# EAGLE design music_box (EAGLE 9.6.2)
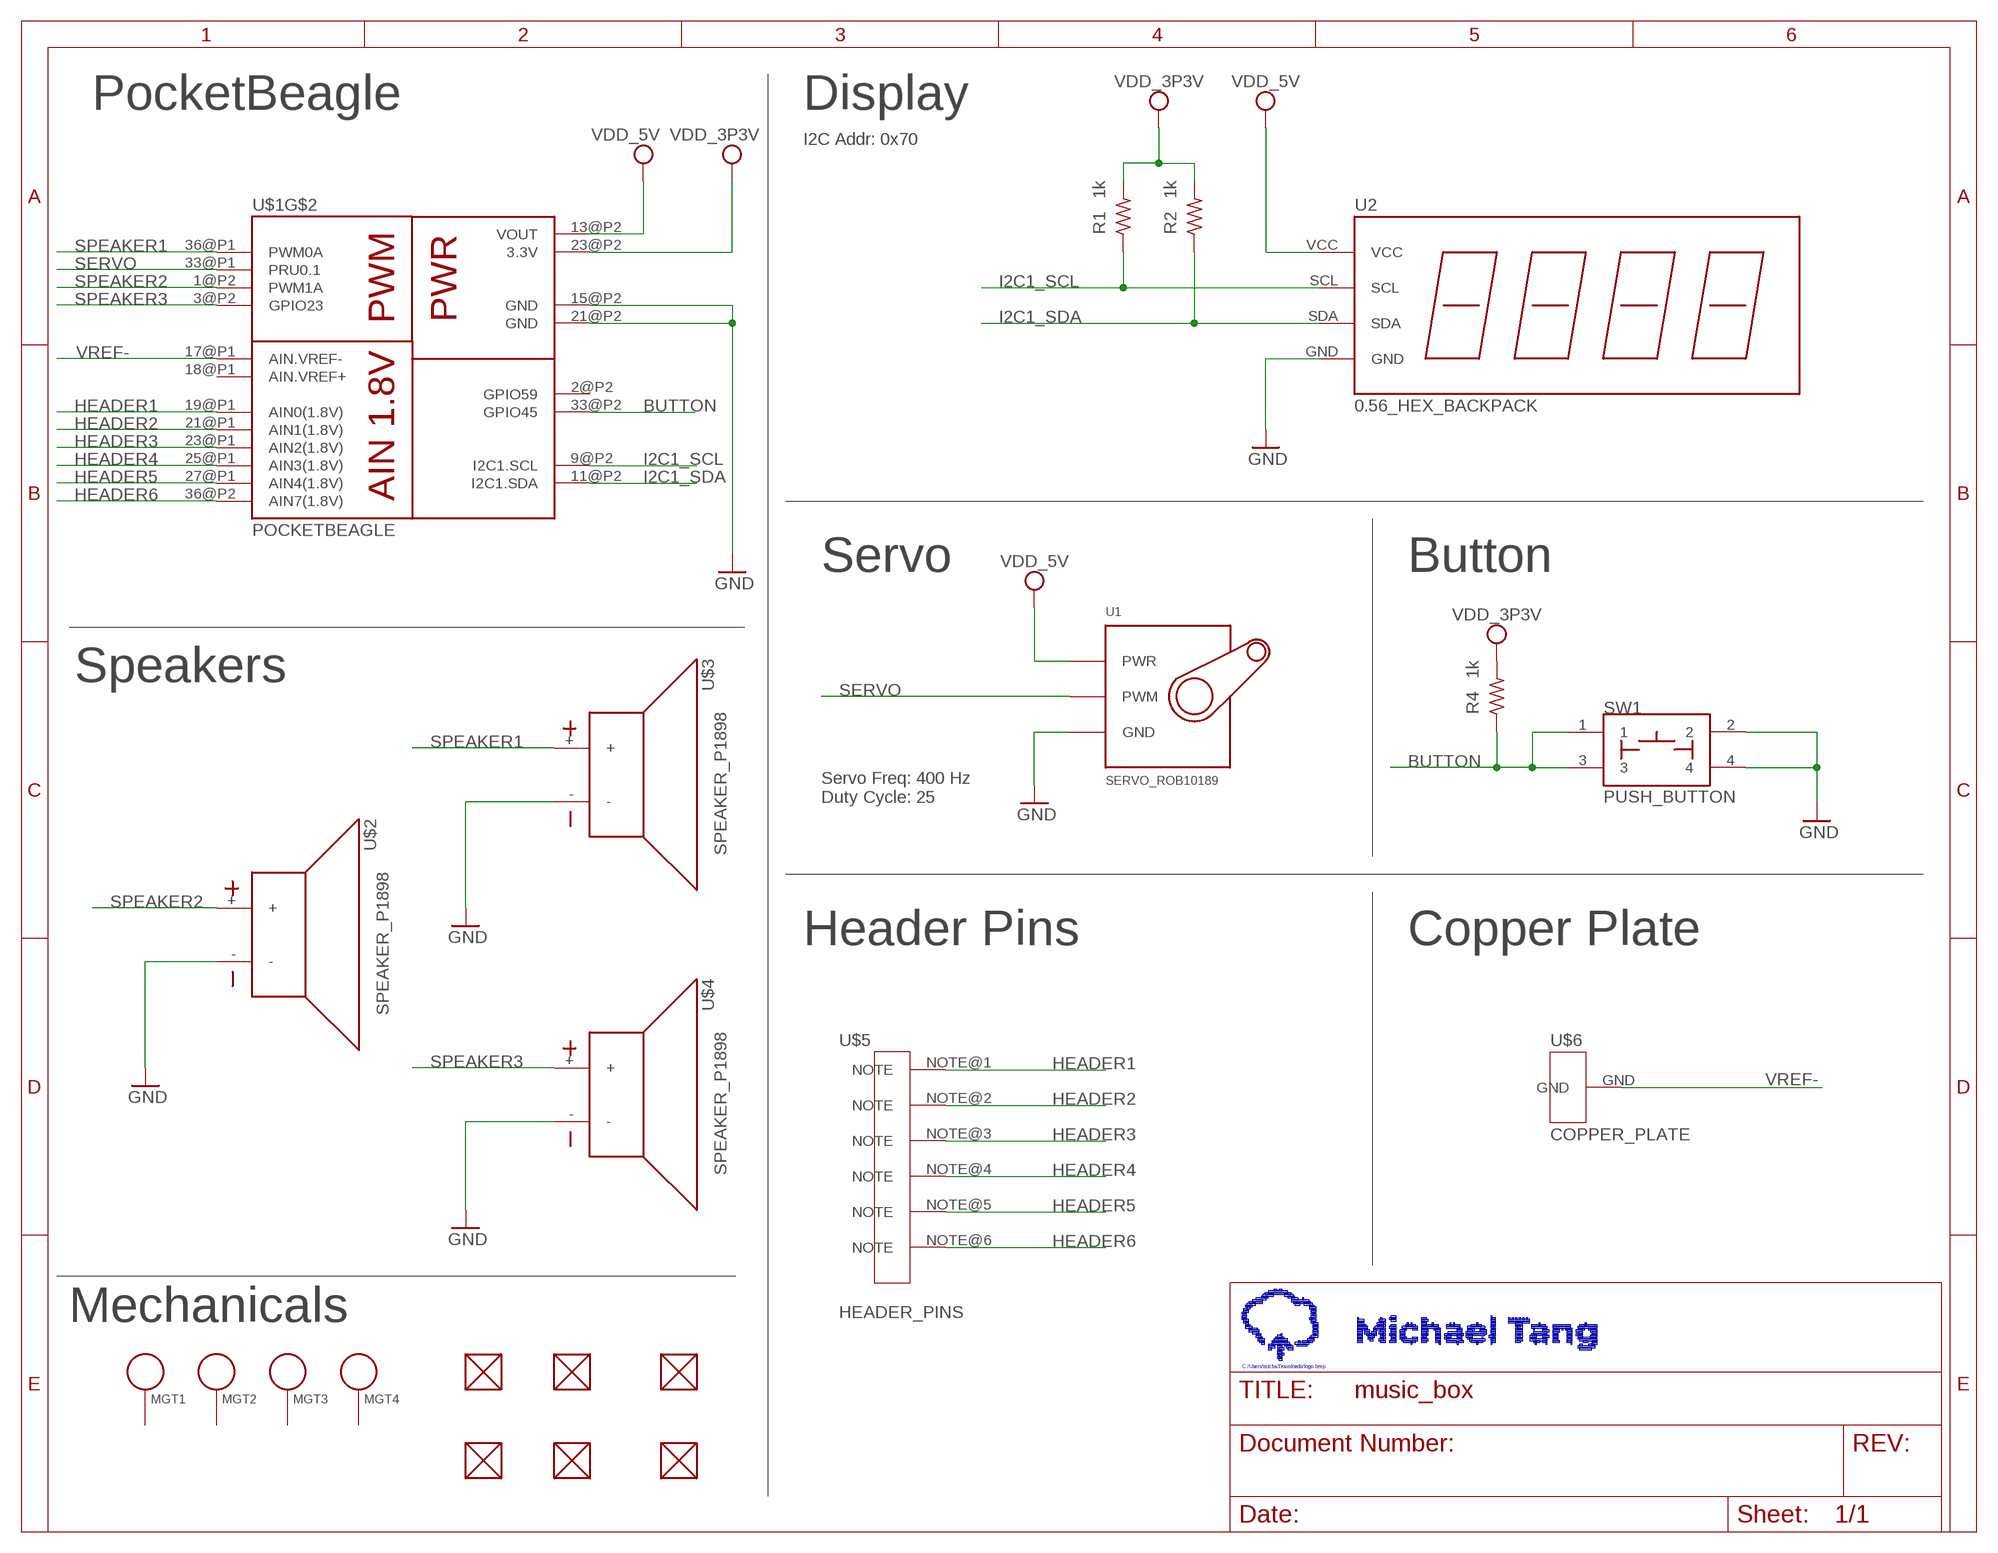
[diagram p0: schematic, sheet 1]

## Parts
FUD1  FIDUCIAL  [FIDUCIAL_40MIL]
FUD2  FIDUCIAL  [FIDUCIAL_40MIL]
FUD3  FIDUCIAL  [FIDUCIAL_40MIL]
FUD4  FIDUCIAL  [FIDUCIAL_40MIL]
FUD5  FIDUCIAL  [FIDUCIAL_40MIL]
FUD6  FIDUCIAL  [FIDUCIAL_40MIL]
MGT1  MOUNTING_HOLE  [MOUNTING_HOLE]
MGT2  MOUNTING_HOLE  [MOUNTING_HOLE]
MGT3  MOUNTING_HOLE  [MOUNTING_HOLE]
MGT4  MOUNTING_HOLE  [MOUNTING_HOLE]
R1  1k  R_R0603  [R0603]
R2  1k  R_R0603  [R0603]
R4  1k  R_R0603  [R0603]
SW1  PUSH_BUTTON  [BUTTON_12.5MM]
U1  SERVO_ROB10189  [SERVO-X1]
U2  0.56_HEX_BACKPACK  [0.56_HEX_BACKPACK]
U$1  POCKETBEAGLE  [POCKETBEAGLE]
U$2  SPEAKER_P1898  [SPEAKER]
U$3  SPEAKER_P1898  [SPEAKER]
U$4  SPEAKER_P1898  [SPEAKER]
U$5  HEADER_PINS  [HEADER_PINS]
U$6  COPPER_PLATE  [COPPER_PLATE]

## Nets
BUTTON: R4.1 SW1.1 SW1.3 U$1.33@P2(GPIO45)
GND: SW1.2 SW1.4 U1.GND U2.GND U$1.15@P2(GND) U$1.21@P2(GND) U$2.- U$3.- U$4.-
HEADER1: U$1.19@P1(AIN0(1.8V)) U$5.NOTE@1(NOTE)
HEADER2: U$1.21@P1(AIN1(1.8V)) U$5.NOTE@2(NOTE)
HEADER3: U$1.23@P1(AIN2(1.8V)) U$5.NOTE@3(NOTE)
HEADER4: U$1.25@P1(AIN3(1.8V)) U$5.NOTE@4(NOTE)
HEADER5: U$1.27@P1(AIN4(1.8V)) U$5.NOTE@5(NOTE)
HEADER6: U$1.36@P2(AIN7(1.8V)) U$5.NOTE@6(NOTE)
I2C1_SCL: R1.1 U2.SCL U$1.9@P2(I2C1.SCL)
I2C1_SDA: R2.1 U2.SDA U$1.11@P2(I2C1.SDA)
SERVO: U1.SIG(PWM) U$1.33@P1(PRU0.1)
SPEAKER1: U$1.36@P1(PWM0A) U$3.+
SPEAKER2: U$1.1@P2(PWM1A) U$2.+
SPEAKER3: U$1.3@P2(GPIO23) U$4.+
VDD_3P3V: R1.2 R2.2 R4.2 U$1.23@P2(3.3V)
VDD_5V: U1.PWR U2.VCC U$1.13@P2(VOUT)
VREF-: U$1.17@P1(AIN.VREF-) U$6.GND
Unconnected: FUD1.P$1 FUD2.P$1 FUD3.P$1 FUD4.P$1 FUD5.P$1 FUD6.P$1 MGT1.P$1 MGT2.P$1 MGT3.P$1 MGT4.P$1 U$1.1@P1(VIN) U$1.2@P1(AIN6/GPIO87) U$1.2@P2(GPIO59) U$1.3@P1(USB1.DRVVBUS) U$1.4@P1(GPIO89) U$1.4@P2(GPIO58) U$1.5@P1(USB1.VBUS) U$1.5@P2(UART4.RX) U$1.6@P1(SPI0.CS) U$1.6@P2(GPIO57) U$1.7@P1(USB1.VIN) U$1.7@P2(UART4.TX) U$1.8@P1(SPI0.CLK) U$1.8@P2(GPIO60) U$1.9@P1(USB1.D-) U$1.10@P1(SPI0.MISO) U$1.10@P2(GPIO52) U$1.11@P1(USB1.D+) U$1.12@P1(SPI0.MOSI) U$1.12@P2(PWR.BTN) U$1.13@P1(USB1.ID) U$1.14@P1(3.3V) U$1.14@P2(BAT.VIN) U$1.15@P1(GND) U$1.16@P1(GND) U$1.16@P2(BAT.TEMP) U$1.17@P2(GPIO65) U$1.18@P1(AIN.VREF+) U$1.18@P2(GPIO47) U$1.19@P2(GPIO27) U$1.20@P1(GPIO20) U$1.20@P2(GPIO64) U$1.22@P1(GND) U$1.22@P2(GPIO46) U$1.24@P1(VOUT) U$1.24@P2(GPIO44) U$1.25@P2(SPI1.MOSI) U$1.26@P1(I2C2.SDA) U$1.26@P2(RESET#) U$1.27@P2(SPI1.MISO) U$1.28@P1(I2C2.SCL) U$1.28@P2(PRU0.6) U$1.29@P1(PRU0.7) U$1.29@P2(SPI1.CLK) U$1.30@P1(UART0.TX) U$1.30@P2(PRU0.3) U$1.31@P1(PRU0.4) U$1.31@P2(SPI1.CS) U$1.32@P1(UART0.RX) U$1.32@P2(PRU0.2) U$1.34@P1(GPIO26) U$1.34@P2(PRU0.5) U$1.35@P1(PRU1.10) U$1.35@P2(AIN5(3.3V))

## Notes on the sheet
- PocketBeagle | Display
- I2C Addr: 0x70
- Servo | Button
- Speakers
- Servo Freq: 400 Hz
  Duty Cycle: 25
- Header Pins | Copper Plate
- Mechanicals
- C:/Users/micha/Downloads/logo.bmp

## Library data of the parts
FUD1-FUD6 = music_box:FIDUCIAL
MGT1-MGT4 = music_box:MOUNTING_HOLE: Chassis Mounting Hole w/GND connection ability
R1 R2 R4 = music_box:R_: RESISTOR, American symbol
SW1 = music_box:PUSH_BUTTON
U1 = music_box:SERVO_ROB10189
U2 = music_box:0.56_HEX_BACKPACK: 0.56" LED HEX Backback - Adafruit HT16K33 - https://www.adafruit.com/product/878 - https://www.adafruit.com/product/879 - https://www.adafruit.com/product/880 - https://www.adafruit.com/product/881 - https://www.adafruit.com/product/1002
U$1 = music_box:POCKETBEAGLE
U$2-U$4 = music_box:SPEAKER_P1898
U$5 = music_box:HEADER_PINS
U$6 = music_box:COPPER_PLATE

## Board
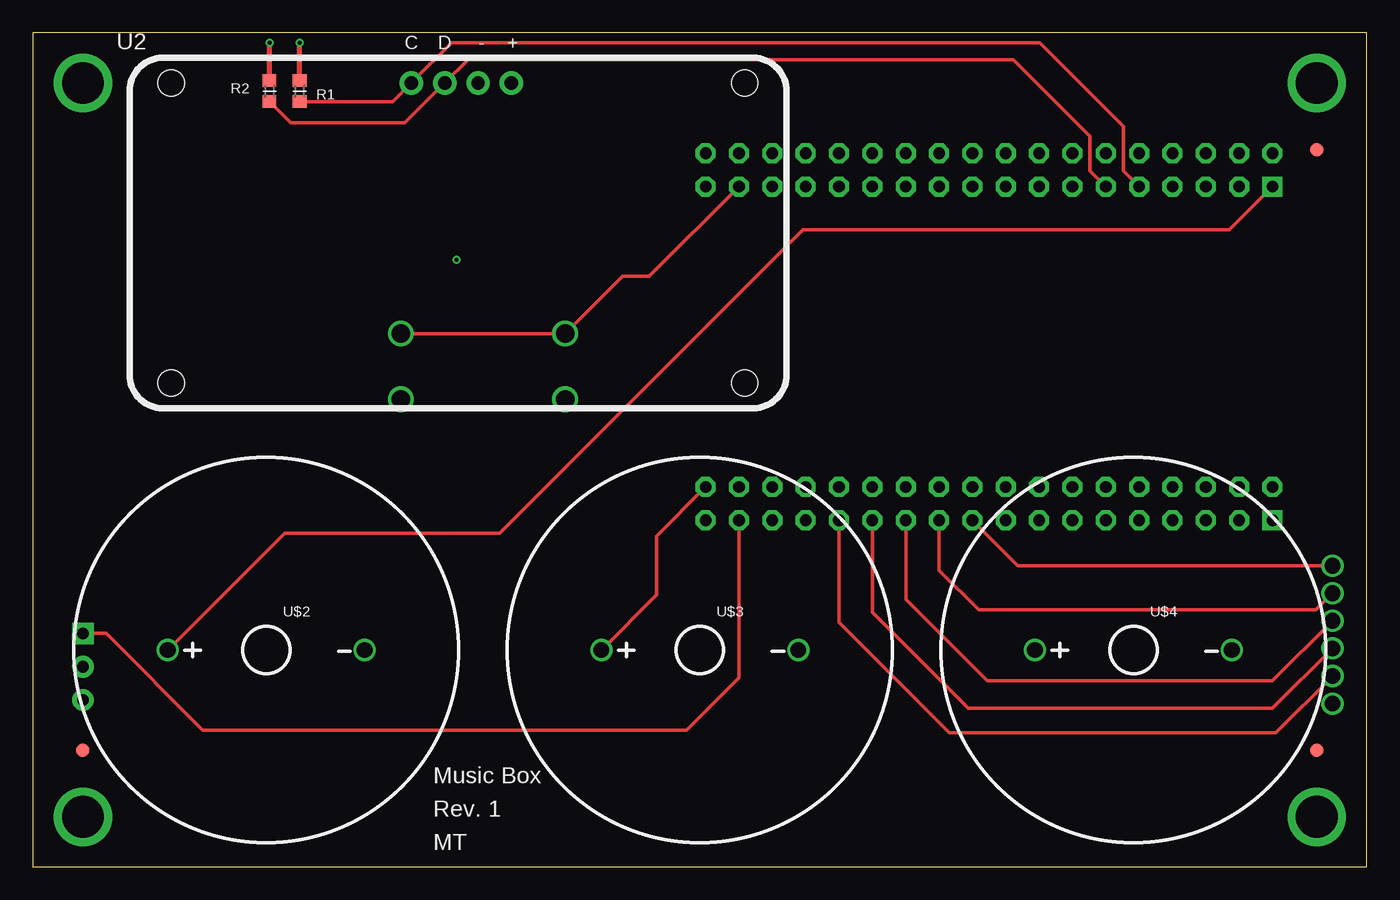
[diagram p1: board, top side]
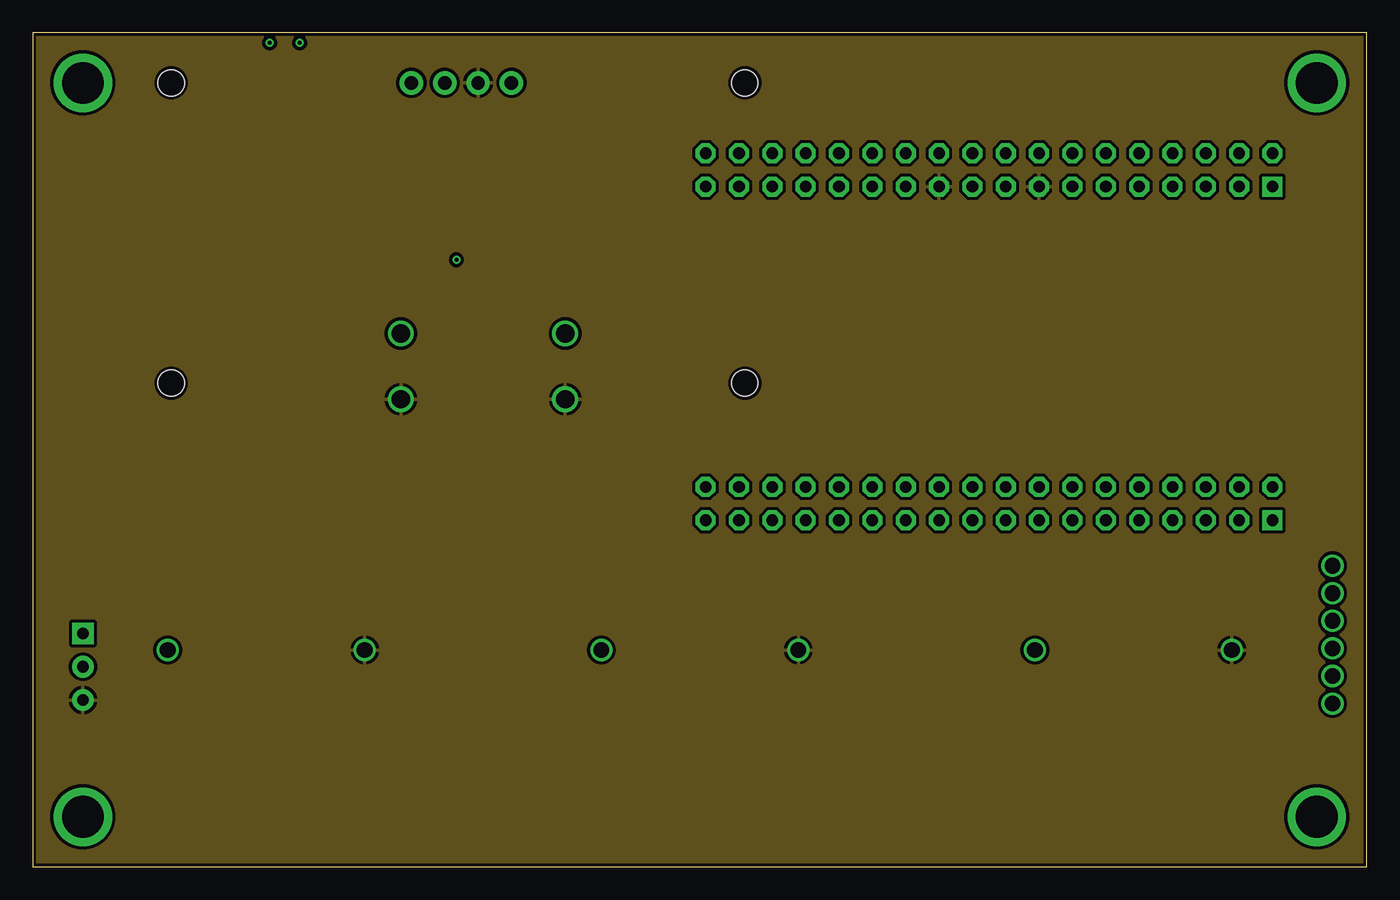
[diagram p2: board, inner layer Route2]
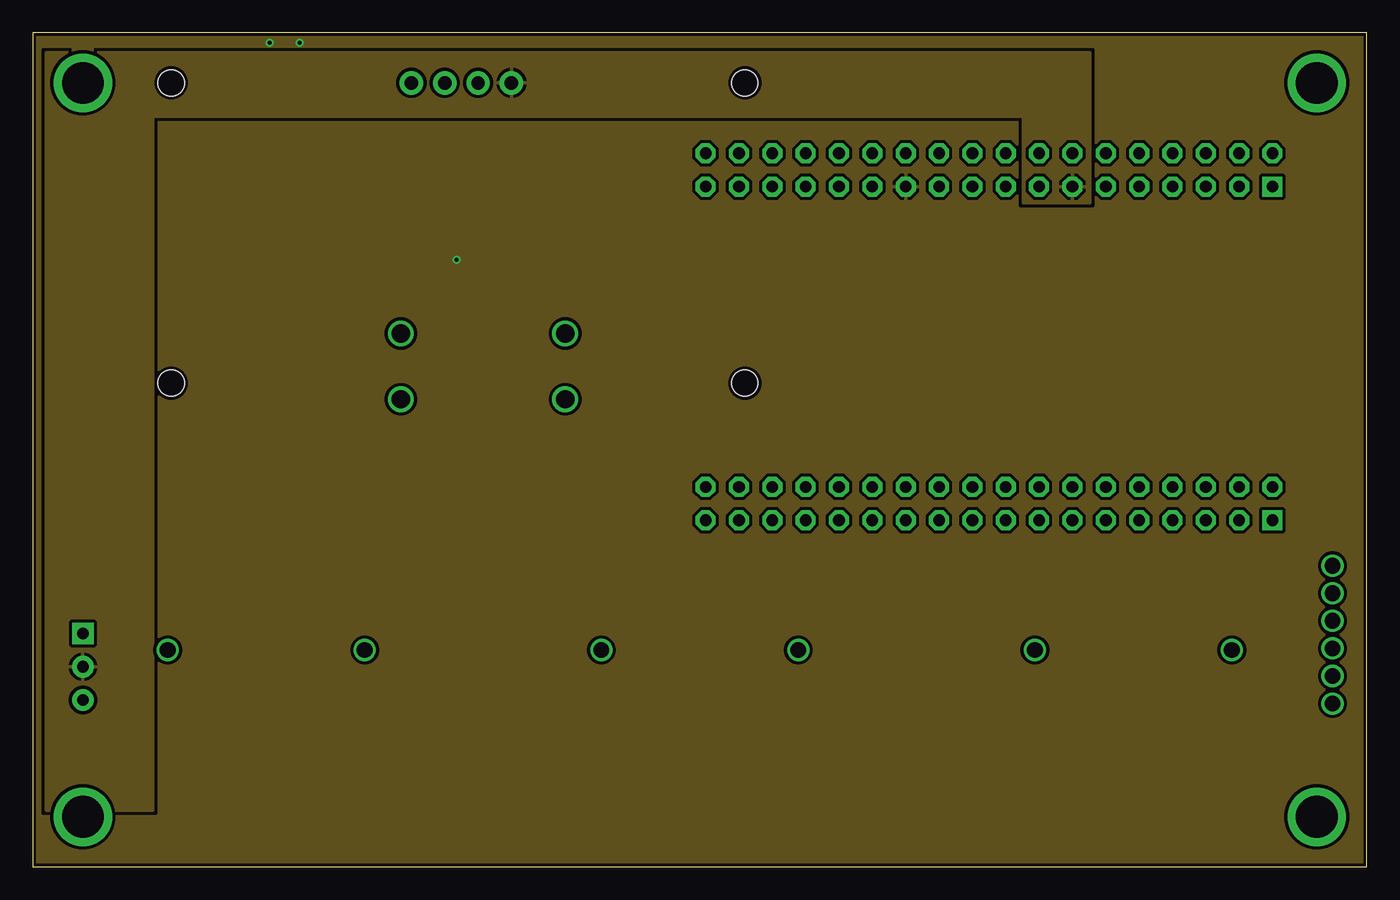
[diagram p3: board, inner layer Route15]
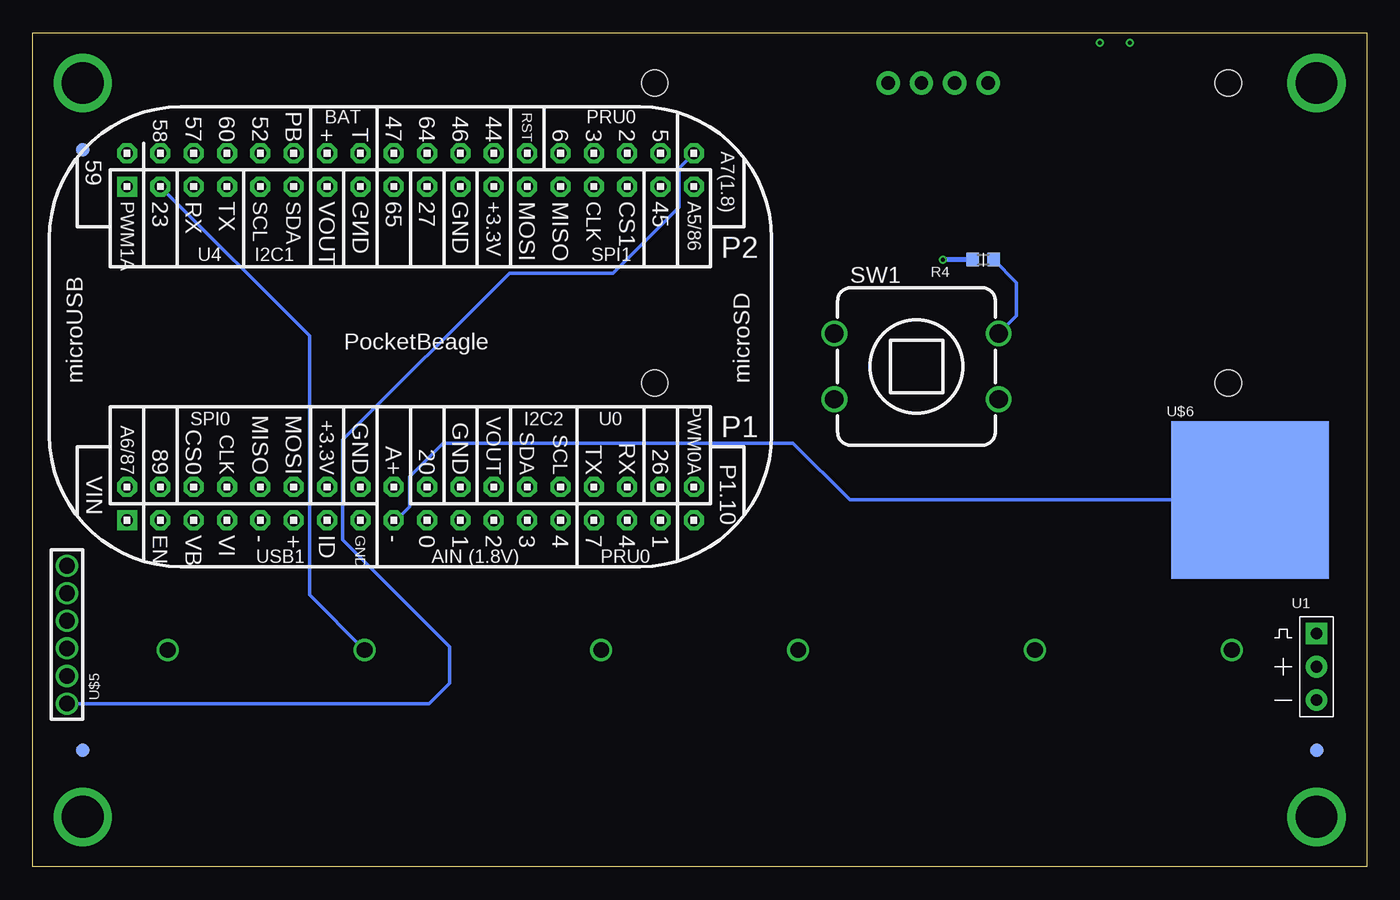
[diagram p4: board, bottom side, seen from below]

Size 101.59 x 63.5 mm. Coordinates in mm from the lower left corner, seen from the top.
Outline: 0,0 101.58,0 101.59,63.5 0.01,63.5 0,0
Copper layers (1*2*15*16): Top 0.035mm / dielectric 0.23mm / Route2 0.035mm / dielectric 0.93mm / Route15 0.035mm / dielectric 0.23mm / Bottom 0.035mm
Design rules "ENGI301_4lyr": minimum track width 10mil, minimum drill 12mil, track to track 10mil, track to pad 10mil, pad to pad 10mil, via to via 10mil, smd to smd 10mil, copper to edge 10mil, drill to drill 12mil, minimum pad ring 6mil, minimum via ring 6mil, stop-mask expansion 3mil, vias tented up to drill 25mil, thermal gap 10mil

### Footprints (pad centres in the part's own frame; a part is rotated, then mirrored left to right if it is on the bottom)
FIDUCIAL_40MIL = smd 1.016 x 1.016: P$1 0,0
MOUNTING_HOLE = drill 3.175 pad 4.445: P$1 0,0
R0603 = smd 0.95 x 1.031: 1 -0.8,0; 2 0.8,0
BUTTON_12.5MM = drill 1.4: 1 -6.25,2.5; 2 -6.25,-2.5; 3 6.25,2.5; 4 6.25,-2.5
SERVO-X1 = drill 0.889 pad 1.651: GND 0,-2.54; PWR 0,0 | drill 0.889 pad 1.651 square: SIG 0,2.54
0.56_HEX_BACKPACK = drill 1.016 pad 1.778: GND 1.524,11.43; SCL -3.556,11.43; SDA -1.016,11.43; VCC 4.064,11.43 | hole 2: -21.844,-11.43; 21.844,-11.43; -21.844,11.43; 21.844,11.43
POCKETBEAGLE = drill 0.889 pad 1.524 square: 1@P1 5.91,3.53; 1@P2 5.91,28.93 | drill 0.889 pad 1.524 octagon: 2@P1 5.91,6.07; 2@P2 5.91,31.47; 3@P1 8.45,3.53; 3@P2 8.45,28.93; 4@P1 8.45,6.07; 4@P2 8.45,31.47; 5@P1 10.99,3.53; 5@P2 10.99,28.93; 6@P1 10.99,6.07; 6@P2 10.99,31.47; 7@P1 13.53,3.53; 7@P2 13.53,28.93; 8@P1 13.53,6.07; 8@P2 13.53,31.47; 9@P1 16.07,3.53; 9@P2 16.07,28.93; 10@P1 16.07,6.07; 10@P2 16.07,31.47; 11@P1 18.61,3.53; 11@P2 18.61,28.93; 12@P1 18.61,6.07; 12@P2 18.61,31.47; 13@P1 21.15,3.53; 13@P2 21.15,28.93; 14@P1 21.15,6.07; 14@P2 21.15,31.47; 15@P1 23.69,3.53; 15@P2 23.69,28.93; 16@P1 23.69,6.07; 16@P2 23.69,31.47; 17@P1 26.23,3.53; 17@P2 26.23,28.93; 18@P1 26.23,6.07; 18@P2 26.23,31.47; 19@P1 28.77,3.53; 19@P2 28.77,28.93; 20@P1 28.77,6.07; 20@P2 28.77,31.47; 21@P1 31.31,3.53; 21@P2 31.31,28.93; 22@P1 31.31,6.07; 22@P2 31.31,31.47; 23@P1 33.85,3.53; 23@P2 33.85,28.93; 24@P1 33.85,6.07; 24@P2 33.85,31.47; 25@P1 36.39,3.53; 25@P2 36.39,28.93; 26@P1 36.39,6.07; 26@P2 36.39,31.47; 27@P1 38.93,3.53; 27@P2 38.93,28.93; 28@P1 38.93,6.07; 28@P2 38.93,31.47; 29@P1 41.47,3.53; 29@P2 41.47,28.93; 30@P1 41.47,6.07; 30@P2 41.47,31.47; 31@P1 44.01,3.53; 31@P2 44.01,28.93; 32@P1 44.01,6.07; 32@P2 44.01,31.47; 33@P1 46.55,3.53; 33@P2 46.55,28.93; 34@P1 46.55,6.07; 34@P2 46.55,31.47; 35@P1 49.09,3.53; 35@P2 49.09,28.93; 36@P1 49.09,6.07; 36@P2 49.09,31.47
SPEAKER = drill 1.2: + -7.5,0; - 7.5,0
HEADER_PINS = drill 1.2: NOTE@1 1.2,1.2; NOTE@2 1.2,3.3; NOTE@3 1.2,5.4; NOTE@4 1.2,7.5; NOTE@5 1.2,9.6; NOTE@6 1.2,11.7
COPPER_PLATE = smd 12 x 12: GND 0,0

### Placement (x,y rotation side)
FUD1  3.81,8.89 0 top
FUD2  97.79,8.89 0 top
FUD3  97.79,54.61 0 top
FUD4  3.81,8.89 0 bottom
FUD5  97.79,8.89 0 bottom
FUD6  97.79,54.61 0 bottom
MGT1  3.81,3.81 0 top
MGT2  97.79,3.81 0 top
MGT3  3.81,59.69 0 top
MGT4  97.79,59.69 0 top
R1  20.32,59.05 90 top
R2  18.03,59.05 90 top
R4  29.21,46.23 180 bottom
SW1  34.29,38.1 0 bottom
U1  3.81,15.24 0 bottom
U2  32.38,48.26 0 top
U$1  100.33,22.86 0 bottom
U$2  17.78,16.51 0 top
U$3  50.8,16.51 0 top
U$4  83.82,16.51 0 top
U$5  97.79,24.13 180 bottom
U$6  8.89,27.94 0 bottom

### Tracks (layer width: path | path; a pad name or v marks a point on that pad's centre or on a via)
BUTTON
  Top 0.254: SW1.3 SW1.1 44.9,44.96 46.95,44.96 U$1.33@P2
  Bottom 0.254: R4.1 26.67,44.49 26.67,41.97 SW1.3
GND
  pour Route2: -2.54,66.04 -2.54,-2.54 104.14,-2.54 104.14,66.04
HEADER1
  Top 0.254: U$1.19@P1 75.02,22.93 U$5.NOTE@1
HEADER2
  Top 0.254: U$5.NOTE@2 97.72,19.56 72.04,19.56 69.02,22.58 U$1.21@P1
HEADER3
  Top 0.254: U$5.NOTE@3 94.42,14.16 72.71,14.16 66.48,20.39 U$1.23@P1
HEADER4
  Top 0.254: U$1.25@P1 63.94,19.37 71.25,12.06 94.42,12.06 U$5.NOTE@4
HEADER5
  Top 0.254: U$1.27@P1 61.4,18.61 69.8,10.21 94.67,10.21 U$5.NOTE@5
HEADER6
  Bottom 0.254: U$5.NOTE@6 71.39,12.43 69.85,13.97 69.85,16.76 77.98,24.89 77.98,32.51 65.28,45.21 57.4,45.21 52.38,50.23 52.38,53.19 U$1.36@P2
I2C1_SCL
  Top 0.254: R1.1 27.39,58.26 U2.SCL 31.88,62.74 76.71,62.74 83.06,56.39 83.06,52.99 U$1.9@P2
I2C1_SDA
  Top 0.254: R2.1 19.65,56.64 28.32,56.64 U2.SDA 33.15,61.47 74.68,61.47 80.52,55.63 80.52,52.99 U$1.11@P2
SERVO
  Top 0.254: U$1.33@P1 53.78,14.41 49.78,10.41 12.95,10.41 5.59,17.78 U1.SIG
SPEAKER1
  Top 0.254: U$3.+ 47.5,20.71 47.5,25.19 U$1.36@P1
SPEAKER2
  Top 0.254: U$1.1@P2 91.14,48.51 66.04,48.51 64.77,48.51 58.67,48.51 35.56,25.4 19.17,25.4 U$2.+
SPEAKER3
  Bottom 0.254: U$4.+ 80.52,20.71 80.52,40.43 U$1.3@P2
VDD_3P3V  (via drill 0.3 pad 0.61)
  Top 0.381: R2.2 v18.03,62.74 | R1.2 v20.32,62.74
  Bottom 0.381: R4.2 v32.26,46.23
  pour Route15 (rank 6): -5.08,68.58 -5.08,-5.08 106.68,-5.08 106.68,68.58
VDD_5V
  pour Route15: 80.52,61.98 80.52,50.55 75.44,50.55 75.44,57.15 9.14,57.15 9.14,4.32 1.02,4.32 1.02,61.98
VREF-
  Bottom 0.254: U$6.GND 39.37,27.94 43.69,32.26 70.36,32.26 72.9,29.72 72.9,27.43 73.94,26.39 U$1.17@P1

### Text on the board
tPlace: Music Box | Rev. 1 | MT